# Altium schematic sheet GPRS.SchDoc: Smart Bus Ticketing Machine/GPRS
size A4; Date: 3/10/2025; ApprovedBy: Kiran Gunathilaka; CheckedBy: Kiran Gunathilaka; Author: Kiran Gunathilaka; DrawnBy: Kiran Gunathilaka; DocumentNumber: 03; Revision: v1.1; SheetNumber: 6; SheetTotal: 11
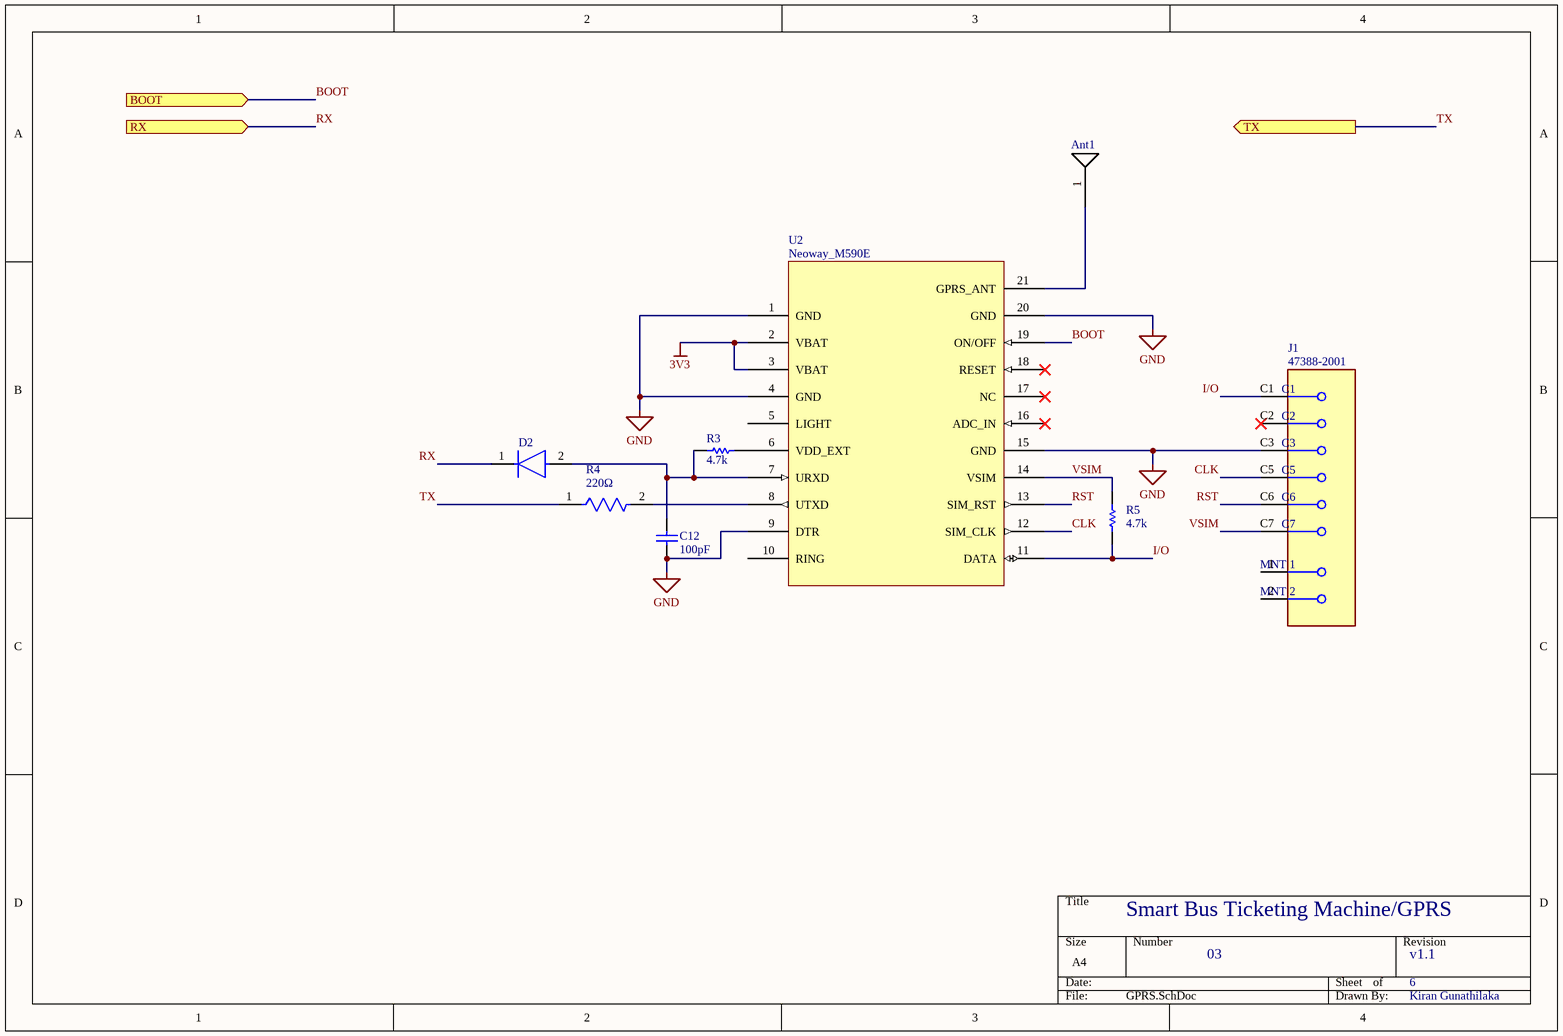
[diagram p0: GPRS.SchDoc]

## Parts
Ant1  (no value)  [Antenna]
C12  value 100pF  [CAPC2013X94X50ML20T25]  (hidden comment: 08051C152KAT2A)
D2  TS4148 RYG  [FP-TS4148_RYG-MFG]  (value not drawn)
J1  47388-2001  [FP-47388-2001-MFG]
R3  value 4.7k  [RESC2013X60X40ML20T25]  (hidden comment: ERA6AEB472V)
R4  value 220Ω  [FP-CRGCQ0805-IPC_C]  (hidden comment: CRGCQ0805F22R)
R5  value 4.7k  [RESC2013X60X40ML20T25]  (hidden comment: ERA6AEB472V)
U2  Neoway_M590E  [Neoway-M590E]

## Ports
BOOT (in, see Main[2C], MCU[4A]), RX (in, see Main[2B]), TX (out, see Main[2B])

## Nets
3V3: U2.2(VBAT) U2.3(VBAT)
GND: C12.1 J1.C3 U2.1(GND) U2.4(GND) U2.9(DTR) U2.15(GND) U2.20(GND)
BOOT: U2.19(ON/OFF) ; port BOOT
CLK: J1.C5 U2.12(SIM_CLK)
I/O: J1.C1 R5.1 U2.11(DATA)
RST: J1.C6 U2.13(SIM_RST)
RX: D2.1(C) ; port RX
TX: R4.1 ; port TX
VSIM: J1.C7 R5.2 U2.14(VSIM)
NetAnt1_1: Ant1.1 U2.21(GPRS_ANT)
NetC12_2: C12.2 D2.2(A) R3.2 U2.7(URXD)
NetR3_1: R3.1 U2.6(VDD_EXT)
NetR4_2: R4.2 U2.8(UTXD)

Not connected (* = marked no-connect by the designer): J1 1(MNT_1) 2(MNT_2) C2*; U2 5(LIGHT) 10(RING) 16(ADC_IN)* 17(NC)* 18(RESET)*

## Library data of the parts
Ant1 = Antenna
C12 = CMP-2007-04179-1: Manufacturer: AVX Interconnect / Elco; Part Number: 08051C152KAT2A
D2 = CMP-15605-000006-1: Rectifier Diode Switching 75V 0.15A 4ns 2-Pin Case 0805(2012Metric) T/R; Peak Non-Repetitive Surge Current: 2A; Element Configuration: Single; Forward Voltage: 1V; Max Operating Temperature: 175°C; Packaging: Tape and Reel; Radiation Hardening: No; Min Operating Temperature: -65°C; Reverse Recovery Time: 4ns; Mount: Surface Mount; RoHS Compliant: Yes; Max Forward Surge Current (Ifsm): 2A; Case/Package: SMD/SMT; Number of Pins: 2; Max Repetitive Reverse Voltage (Vrrm): 75V
J1 = CMP-04763-000009-1: CONN SIM CARD HINGED TYPE R/A; Pitch: 2.54mm; Number of Circuits: 478; Current Rating: 500mA; Gender: Female; Voltage Rating: 5V; Row Spacing: 16.8mm; Number of Contacts: 6; Connector Type: Socket; Termination: SMD/SMT; Mount: Surface Mount; Contact Plating: Gold; Orientation: Horizontal; Series: 47388; Packaging: Tape and Reel; Number of Rows: 1; Min Operating Temperature: -40°C; Max Operating Temperature: 85°C; RoHS Compliant: Yes; Housing Material: Thermoplastic; Contact Material: Bronze
R3 R5 = CMP-2001-00644-1: Manufacturer: Panasonic; Part Number: ERA6AEB472V
R4 = CMP-03211-006853-1: CRGCQ 0805 22R 1%; Manufacturer: TE Connectivity; Voltage Rating: 150V; Tolerance: 0.01; Power Rating: 0.125W; Resistance: 22Ω; Automotive Grade: Grade 301; Temperature Coefficient: ±200ppm/°C; Temperature: -55°C to +155°C; Digikey Description: CRGCQ 0805 22R 1%; Ipc Land Pattern Name: RESC200125X55; Temperature Range Low: -55°C; ComponentLink2URL: https://www.te.com/commerce/DocumentDelivery/DDEController?Action=showdoc&DocId=Data+Sheet%7F1773204-3%7F1%7Fpdf%7FEnglish%7FENG_DS_1773204-3_1.pdf%7F4-2176341-310; Package: CRGCQ0805; Octopart: https://octopart.com/crgcq0805f22r-te+connectivity-91018162; Height: 0.65mm; Ambient Temperature Range High: +70°C; Manufacturer Part Number: CRGCQ0805F22R; Device Class L2: Resistors; Composition: Thick Film; Temperature Range High: +155°C; Device Class L3: Chip SMD Resistors; RoHS: TRUE; Lead Free: Yes; Mouser Description: SMD AEC-Q200 Compliant Thick Film Chip Resistor; Device Class L1: Passive Components; ComponentLink2Description: Datasheet; Series: CRGCQ; Category: Res; Automotive: Yes